# Altium schematic sheet Display_SEC_MIN.SchDoc
size A; SheetNumber: 1; SheetTotal: 3
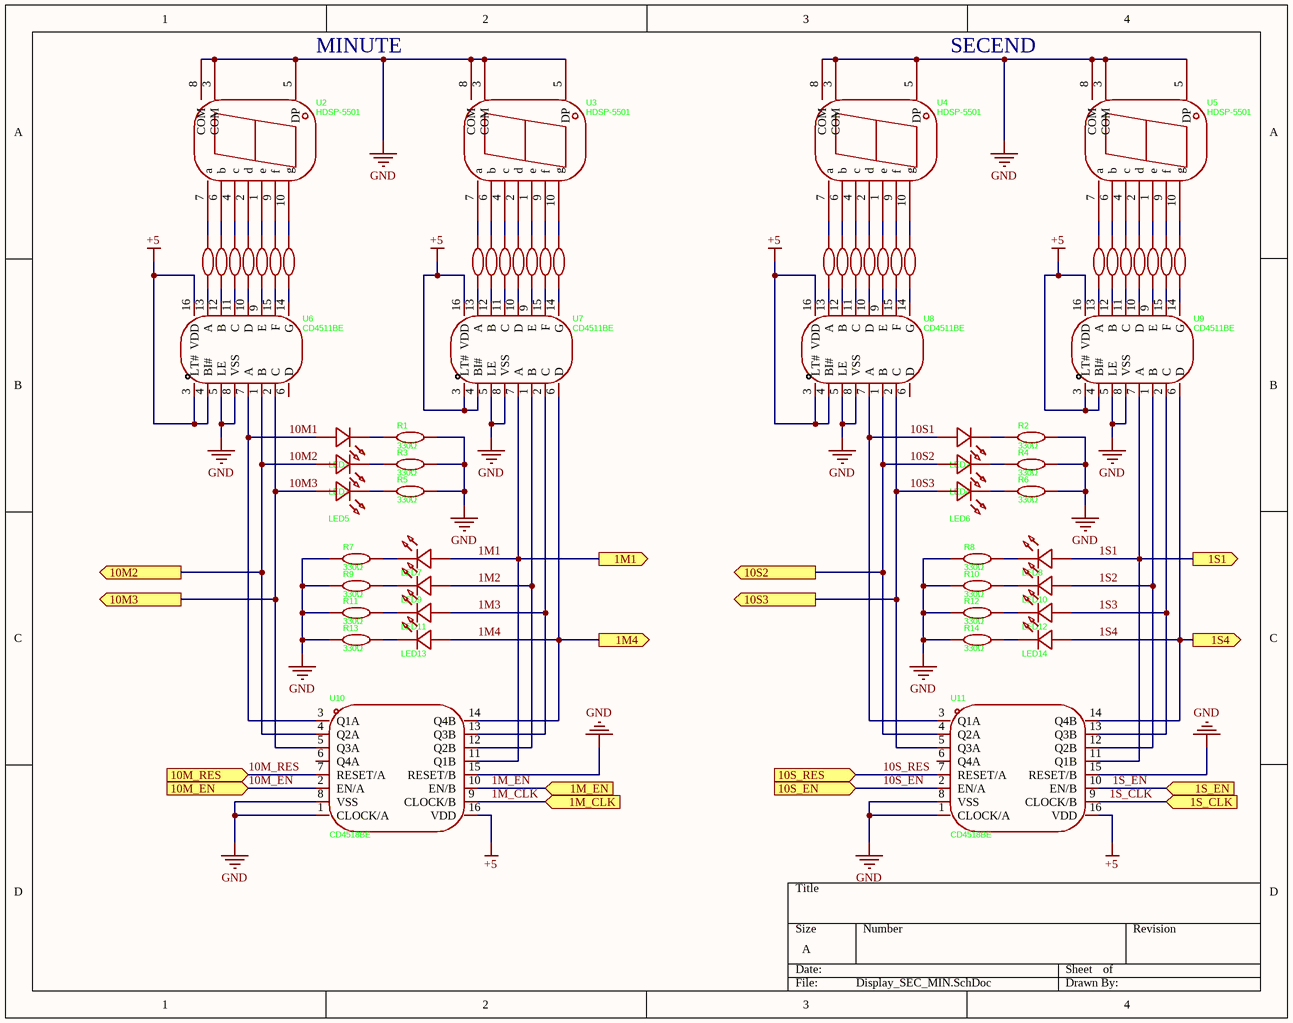
[diagram p0: Display_SEC_MIN.SchDoc]

## Parts
LED1  WP7113ID  [LED-TH_BD5.0-P2.54-FD]  (value not drawn)
LED2  WP7113ID  [LED-TH_BD5.0-P2.54-FD]  (value not drawn)
LED3  WP7113ID  [LED-TH_BD5.0-P2.54-FD]  (value not drawn)
LED4  WP7113ID  [LED-TH_BD5.0-P2.54-FD]  (value not drawn)
LED5  WP7113ID  [LED-TH_BD5.0-P2.54-FD]  (value not drawn)
LED6  WP7113ID  [LED-TH_BD5.0-P2.54-FD]  (value not drawn)
LED7  WP7113ID  [LED-TH_BD5.0-P2.54-FD]  (value not drawn)
LED8  WP7113ID  [LED-TH_BD5.0-P2.54-FD]  (value not drawn)
LED9  WP7113ID  [LED-TH_BD5.0-P2.54-FD]  (value not drawn)
LED10  WP7113ID  [LED-TH_BD5.0-P2.54-FD]  (value not drawn)
LED11  WP7113ID  [LED-TH_BD5.0-P2.54-FD]  (value not drawn)
LED12  WP7113ID  [LED-TH_BD5.0-P2.54-FD]  (value not drawn)
LED13  WP7113ID  [LED-TH_BD5.0-P2.54-FD]  (value not drawn)
LED14  WP7113ID  [LED-TH_BD5.0-P2.54-FD]  (value not drawn)
R1  330Ω  [RES-TH_BD2.3-L6.5-P10.50-D0.5]
R2  330Ω  [RES-TH_BD2.3-L6.5-P10.50-D0.5]
R3  330Ω  [RES-TH_BD2.3-L6.5-P10.50-D0.5]
R4  330Ω  [RES-TH_BD2.3-L6.5-P10.50-D0.5]
R5  330Ω  [RES-TH_BD2.3-L6.5-P10.50-D0.5]
R6  330Ω  [RES-TH_BD2.3-L6.5-P10.50-D0.5]
R7  330Ω  [RES-TH_BD2.3-L6.5-P10.50-D0.5]
R8  330Ω  [RES-TH_BD2.3-L6.5-P10.50-D0.5]
R9  330Ω  [RES-TH_BD2.3-L6.5-P10.50-D0.5]
R10  330Ω  [RES-TH_BD2.3-L6.5-P10.50-D0.5]
R11  330Ω  [RES-TH_BD2.3-L6.5-P10.50-D0.5]
R12  330Ω  [RES-TH_BD2.3-L6.5-P10.50-D0.5]
R13  330Ω  [RES-TH_BD2.3-L6.5-P10.50-D0.5]
R14  330Ω  [RES-TH_BD2.3-L6.5-P10.50-D0.5]
R30  330Ω  [RES-TH_BD2.3-L6.5-P10.50-D0.5]  (value not drawn)
R31  330Ω  [RES-TH_BD2.3-L6.5-P10.50-D0.5]  (value not drawn)
R32  330Ω  [RES-TH_BD2.3-L6.5-P10.50-D0.5]  (value not drawn)
R33  330Ω  [RES-TH_BD2.3-L6.5-P10.50-D0.5]  (value not drawn)
R34  330Ω  [RES-TH_BD2.3-L6.5-P10.50-D0.5]  (value not drawn)
R35  330Ω  [RES-TH_BD2.3-L6.5-P10.50-D0.5]  (value not drawn)
R36  330Ω  [RES-TH_BD2.3-L6.5-P10.50-D0.5]  (value not drawn)
R37  330Ω  [RES-TH_BD2.3-L6.5-P10.50-D0.5]  (value not drawn)
R38  330Ω  [RES-TH_BD2.3-L6.5-P10.50-D0.5]  (value not drawn)
R39  330Ω  [RES-TH_BD2.3-L6.5-P10.50-D0.5]  (value not drawn)
R40  330Ω  [RES-TH_BD2.3-L6.5-P10.50-D0.5]  (value not drawn)
R41  330Ω  [RES-TH_BD2.3-L6.5-P10.50-D0.5]  (value not drawn)
R42  330Ω  [RES-TH_BD2.3-L6.5-P10.50-D0.5]  (value not drawn)
R43  330Ω  [RES-TH_BD2.3-L6.5-P10.50-D0.5]  (value not drawn)
R44  330Ω  [RES-TH_BD2.3-L6.5-P10.50-D0.5]  (value not drawn)
R45  330Ω  [RES-TH_BD2.3-L6.5-P10.50-D0.5]  (value not drawn)
R46  330Ω  [RES-TH_BD2.3-L6.5-P10.50-D0.5]  (value not drawn)
R47  330Ω  [RES-TH_BD2.3-L6.5-P10.50-D0.5]  (value not drawn)
R48  330Ω  [RES-TH_BD2.3-L6.5-P10.50-D0.5]  (value not drawn)
R49  330Ω  [RES-TH_BD2.3-L6.5-P10.50-D0.5]  (value not drawn)
R50  330Ω  [RES-TH_BD2.3-L6.5-P10.50-D0.5]  (value not drawn)
R51  330Ω  [RES-TH_BD2.3-L6.5-P10.50-D0.5]  (value not drawn)
R52  330Ω  [RES-TH_BD2.3-L6.5-P10.50-D0.5]  (value not drawn)
R53  330Ω  [RES-TH_BD2.3-L6.5-P10.50-D0.5]  (value not drawn)
R54  330Ω  [RES-TH_BD2.3-L6.5-P10.50-D0.5]  (value not drawn)
R55  330Ω  [RES-TH_BD2.3-L6.5-P10.50-D0.5]  (value not drawn)
R56  330Ω  [RES-TH_BD2.3-L6.5-P10.50-D0.5]  (value not drawn)
R57  330Ω  [RES-TH_BD2.3-L6.5-P10.50-D0.5]  (value not drawn)
U2  HDSP-5501  [LED-SEG-TH_HDSP-A]
U3  HDSP-5501  [LED-SEG-TH_HDSP-A]
U4  HDSP-5501  [LED-SEG-TH_HDSP-A]
U5  HDSP-5501  [LED-SEG-TH_HDSP-A]
U6  CD4511BE  [DIP-16_L19.8-W6.5-P2.54-LS7.6-BL]
U7  CD4511BE  [DIP-16_L19.8-W6.5-P2.54-LS7.6-BL]
U8  CD4511BE  [DIP-16_L19.8-W6.5-P2.54-LS7.6-BL]
U9  CD4511BE  [DIP-16_L19.8-W6.5-P2.54-LS7.6-BL]
U10  CD4518BE  [DIP-16_L19.3-W6.4-P2.54-LS7.6-BL]
U11  CD4518BE  [DIP-16_L19.3-W6.4-P2.54-LS7.6-BL]

## Ports
1M1 (out, see Display_Hour[2A]), 1M4 (out, see Display_Hour[2A]), 1M_CLK (in, see Display_Hour[1A]), 1M_EN (in, see Display_Hour[1C]), 1S1 (out, see Display_Hour[1A]), 1S4 (out, see Display_Hour[1A]), 1S_CLK (in, see Display_Hour[2B]), 1S_EN (in, see Display_Hour[1D]), 10M2 (out, see Display_Hour[2A]), 10M3 (out, see Display_Hour[2A]), 10M_EN (in, see Display_Hour[3B]), 10M_RES (in, see Display_Hour[2A]), 10S2 (out, see Display_Hour[1A]), 10S3 (out, see Display_Hour[1A]), 10S_EN (in, see Display_Hour[1A]), 10S_RES (in, see Display_Hour[1A])

## Nets
+5: U6.3(LT#) U6.4(BI#) U6.16(VDD) U7.3(LT#) U7.4(BI#) U7.16(VDD) U8.3(LT#) U8.4(BI#) U8.16(VDD) U9.3(LT#) U9.4(BI#) U9.16(VDD) U10.16(VDD) U11.16(VDD)
GND: R1.2 R2.2 R3.2 R4.2 R5.2 R6.2 R7.1 R8.1 R9.1 R10.1 R11.1 R12.1 R13.1 R14.1 U2.3(COM) U2.5(DP) U2.8(COM) U3.3(COM) U3.5(DP) U3.8(COM) U4.3(COM) U4.5(DP) U4.8(COM) U5.3(COM) U5.5(DP) U5.8(COM) U6.5(LE) U6.8(VSS) U7.5(LE) U7.8(VSS) U8.5(LE) U8.8(VSS) U9.5(LE) U9.8(VSS) U10.1(CLOCK/A) U10.8(VSS) U10.15(RESET/B) U11.1(CLOCK/A) U11.8(VSS) U11.15(RESET/B)
1M1: LED7.1(A) U7.7(A) U10.11(Q1B) ; port 1M1
1M2: LED9.1(A) U7.1(B) U10.12(Q2B)
1M3: LED11.1(A) U7.2(C) U10.13(Q3B)
1M4: LED13.1(A) U7.6(D) U10.14(Q4B) ; port 1M4
1M_CLK: U10.9(CLOCK/B) ; port 1M_CLK
1M_EN: U10.10(EN/B) ; port 1M_EN
1S1: LED8.1(A) U9.7(A) U11.11(Q1B) ; port 1S1
1S2: LED10.1(A) U9.1(B) U11.12(Q2B)
1S3: LED12.1(A) U9.2(C) U11.13(Q3B)
1S4: LED14.1(A) U9.6(D) U11.14(Q4B) ; port 1S4
1S_CLK: U11.9(CLOCK/B) ; port 1S_CLK
1S_EN: U11.10(EN/B) ; port 1S_EN
10M1: LED1.1(A) U6.7(A) U10.3(Q1A)
10M2: LED3.1(A) U6.1(B) U10.4(Q2A) ; port 10M2
10M3: LED5.1(A) U6.2(C) U10.5(Q3A) ; port 10M3
10M_EN: U10.2(EN/A) ; port 10M_EN
10M_RES: U10.7(RESET/A) ; port 10M_RES
10S1: LED2.1(A) U8.7(A) U11.3(Q1A)
10S2: LED4.1(A) U8.1(B) U11.4(Q2A) ; port 10S2
10S3: LED6.1(A) U8.2(C) U11.5(Q3A) ; port 10S3
10S_EN: U11.2(EN/A) ; port 10S_EN
10S_RES: U11.7(RESET/A) ; port 10S_RES
NetLED1_2: LED1.2(K) R1.1
NetLED2_2: LED2.2(K) R2.1
NetLED3_2: LED3.2(K) R3.1
NetLED4_2: LED4.2(K) R4.1
NetLED5_2: LED5.2(K) R5.1
NetLED6_2: LED6.2(K) R6.1
NetLED7_2: LED7.2(K) R7.2
NetLED8_2: LED8.2(K) R8.2
NetLED9_2: LED9.2(K) R9.2
NetLED10_2: LED10.2(K) R10.2
NetLED11_2: LED11.2(K) R11.2
NetLED12_2: LED12.2(K) R12.2
NetLED13_2: LED13.2(K) R13.2
NetLED14_2: LED14.2(K) R14.2
NetR30_1: R30.1 U6.13(A)
NetR30_2: R30.2 U2.7(a)
NetR31_1: R31.1 U6.12(B)
NetR31_2: R31.2 U2.6(b)
NetR32_1: R32.1 U6.11(C)
NetR32_2: R32.2 U2.4(c)
NetR33_1: R33.1 U6.10(D)
NetR33_2: R33.2 U2.2(d)
NetR34_1: R34.1 U6.9(E)
NetR34_2: R34.2 U2.1(e)
NetR35_1: R35.1 U6.15(F)
NetR35_2: R35.2 U2.9(f)
NetR36_1: R36.1 U6.14(G)
NetR36_2: R36.2 U2.10(g)
NetR37_1: R37.1 U7.13(A)
NetR37_2: R37.2 U3.7(a)
NetR38_1: R38.1 U7.12(B)
NetR38_2: R38.2 U3.6(b)
NetR39_1: R39.1 U7.11(C)
NetR39_2: R39.2 U3.4(c)
NetR40_1: R40.1 U7.10(D)
NetR40_2: R40.2 U3.2(d)
NetR41_1: R41.1 U7.9(E)
NetR41_2: R41.2 U3.1(e)
NetR42_1: R42.1 U7.15(F)
NetR42_2: R42.2 U3.9(f)
NetR43_1: R43.1 U7.14(G)
NetR43_2: R43.2 U3.10(g)
NetR44_1: R44.1 U8.13(A)
NetR44_2: R44.2 U4.7(a)
NetR45_1: R45.1 U8.12(B)
NetR45_2: R45.2 U4.6(b)
NetR46_1: R46.1 U8.11(C)
NetR46_2: R46.2 U4.4(c)
NetR47_1: R47.1 U8.10(D)
NetR47_2: R47.2 U4.2(d)
NetR48_1: R48.1 U8.9(E)
NetR48_2: R48.2 U4.1(e)
NetR49_1: R49.1 U8.15(F)
NetR49_2: R49.2 U4.9(f)
NetR50_1: R50.1 U8.14(G)
NetR50_2: R50.2 U4.10(g)
NetR51_1: R51.1 U9.13(A)
NetR51_2: R51.2 U5.7(a)
NetR52_1: R52.1 U9.12(B)
NetR52_2: R52.2 U5.6(b)
NetR53_1: R53.1 U9.11(C)
NetR53_2: R53.2 U5.4(c)
NetR54_1: R54.1 U9.10(D)
NetR54_2: R54.2 U5.2(d)
NetR55_1: R55.1 U9.9(E)
NetR55_2: R55.2 U5.1(e)
NetR56_1: R56.1 U9.15(F)
NetR56_2: R56.2 U5.9(f)
NetR57_1: R57.1 U9.14(G)
NetR57_2: R57.2 U5.10(g)

Not connected (* = marked no-connect by the designer): U6 6(D); U8 6(D); U10 6(Q4A); U11 6(Q4A)

## Notes on the sheet
- (near U2) MINUTE
- (near U4) SECEND

## Library data of the parts
LED1-LED14 = D_LED_2mm_red: Manufacturer: Kingbright; Add into BOM: yes; Emitted Color: Red; Forward Voltage (VF): 2V; Forward Current: 20mA; Dominant Wavelength: 617nm; Peak Wavelength: 627nm; Lens Color: Red Lens; Luminous Intensity: 40mcd; Viewing Angle: 30°; Symbol: WP7113ID; Device: WP7113ID; LCSC Part Name: WP7113ID; Supplier Part: C6926004; Manufacturer Part: WP7113ID; Supplier Footprint: 插件,D=5mm; JLCPCB Part Class: Extended Part; Datasheet: https://atta.szlcsc.com/upload/public/pdf/source/20241101/124CAE47E7911E6EBC0B1714F77DAFC6.pdf; Supplier: LCSC; Convert to PCB: yes
R1-R14 R30-R57 = Reg_330R_0.25W: Manufacturer: CCO(千志电子); Symbol: MF1/4W-330Ω±1% T52; Device: MF1/4W-330Ω±1% T; Add into BOM: yes; Tolerance: ±1%; Voltage-Supply(Max): 250V; Power(Watts): 250mW; Temperature Coefficient: ±100ppm/℃; LCSC Part Name: 330Ω ±1% 250mW 金属膜电阻; Supplier Part: C119313; Manufacturer Part: MF1/4W-330Ω±1% T; Supplier Footprint: 插件,D2.3xL6.5mm; JLCPCB Part Class: Extended Part; Datasheet: https://atta.szlcsc.com/upload/public/pdf/source/20190910/C427326_62A6D058BC0FF74963A2F22379CA06CE.pdf; Supplier: LCSC; Convert to PCB: yes; Type: Metal Film Resistors; Value: 330Ω; Operating Temperature: -55℃~+155℃
U2-U5 = HDSP-5501: Manufacturer: Broadcom/AVAGO(安华高); Symbol: HDSP-5501_C18198807; Add into BOM: yes; Device: HDSP-5501_C18198807; LCSC Part Name: HDSP-5501; Supplier Part: C18198807; Manufacturer Part: HDSP-5501; Supplier Footprint: 插件; JLCPCB Part Class: Extended Part; Datasheet: https://atta.szlcsc.com/upload/public/pdf/source/20230925/D6197A9C41D1E502B523821274CC57EA.pdf; Supplier: LCSC; Convert to PCB: yes
U6-U9 = CD4511BE_C507153: Manufacturer: HGSEMI(华冠); Add into BOM: yes; Symbol: CD4511BE_C507153; Device: CD4511BE_C507153; LCSC Part Name: CMOS BCD 到 7 段 LED 锁存解码器驱动器; Supplier Part: C507153; Manufacturer Part: CD4511BE; Supplier Footprint: DIP-16; JLCPCB Part Class: Extended Part; Datasheet: https://atta.szlcsc.com/upload/public/pdf/source/20220513/69A3CD8936477BC6706446B8F2E34C07.pdf; Supplier: LCSC; Convert to PCB: yes
U10 U11 = CD4518BE: Manufacturer: TI(德州仪器); Add into BOM: yes; Logic Type: BCDCounter; Direction: Rising Edge；Falling Edge; Voltage - Supply: 3V~18V; Number of Elements: 2; Reset: Asynchronous; Timing: Synchronous; Count Rate: 8MHz; Symbol: CD4518BE; Device: CD4518BE; LCSC Part Name: CD4518BE; Supplier Part: C5220; Manufacturer Part: CD4518BE; Supplier Footprint: DIP-16; JLCPCB Part Class: Extended Part; Datasheet: https://www.ti.com/cn/lit/gpn/cd4518b; Supplier: LCSC; Convert to PCB: yes; Operating Temperature: -55℃~+125℃